# Altium project foxbms2-master.PrjPcb (part 7 of 8)

## Sheet interlock.SchDoc
size A3; DocumentNumber: 14; SheetNumber: 14; SheetTotal: 45; SheetDescription: Interlock Circuit
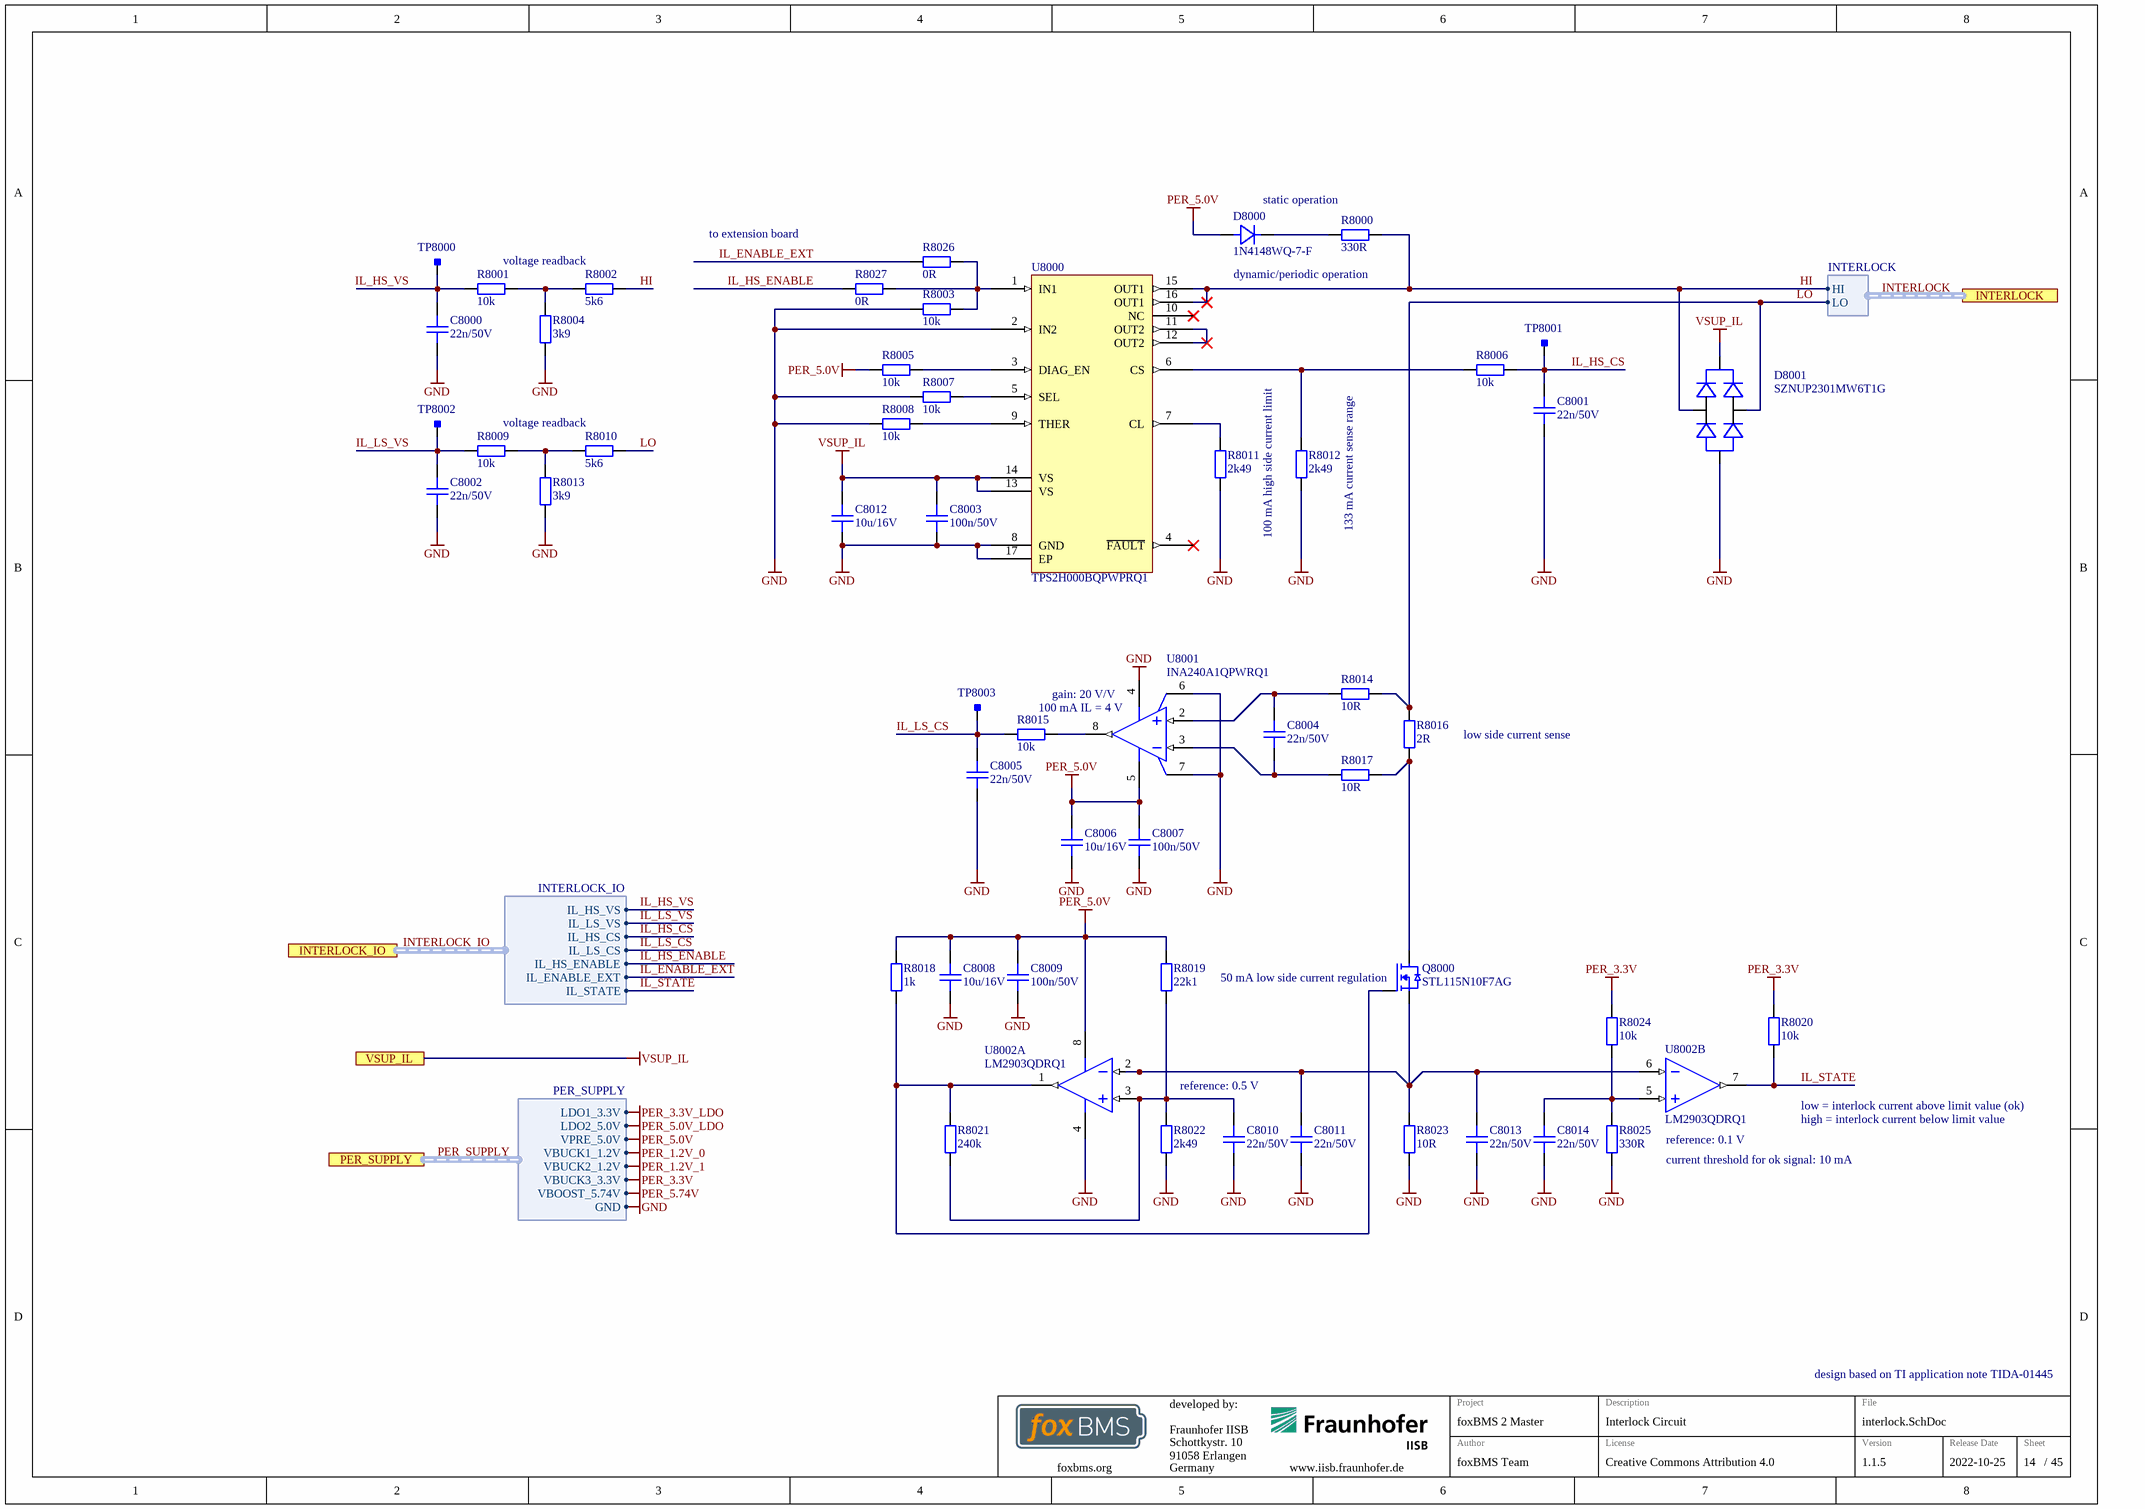
[diagram p43: interlock.SchDoc]

### Parts
C8000  22n/50V  [CAPC1005X06N]
C8001  22n/50V  [CAPC1005X06N]
C8002  22n/50V  [CAPC1005X06N]
C8003  100n/50V  [CAPC1005X06N]
C8004  22n/50V  [CAPC1005X06N]
C8005  22n/50V  [CAPC1005X06N]
C8006  10u/16V  [CAPC2012X14N]
C8007  100n/50V  [CAPC1005X06N]
C8008  10u/16V  [CAPC2012X14N]
C8009  100n/50V  [CAPC1005X06N]
C8010  22n/50V  [CAPC1005X06N]
C8011  22n/50V  [CAPC1005X06N]
C8012  10u/16V  [CAPC2012X14N]
C8013  22n/50V  [CAPC1005X06N]
C8014  22n/50V  [CAPC1005X06N]
D8000  1N4148WQ-7-F  [SOD-123_CASE-425-04-ISSUE-G]
D8001  SZNUP2301MW6T1G  [ONSEMI_SC-88_SOT-363]
Q8000  STL115N10F7AG  [ST_PowerFLAT_5x6_WF_type_C]
R8000  330R  [RESC1608X05N]
R8001  10k  [RESC1005X04N]
R8002  5k6  [RESC1005X04N]
R8003  10k  [RESC1005X04N]
R8004  3k9  [RESC1005X04N]
R8005  10k  [RESC1005X04N]
R8006  10k  [RESC1005X04N]
R8007  10k  [RESC1005X04N]
R8008  10k  [RESC1005X04N]
R8009  10k  [RESC1005X04N]
R8010  5k6  [RESC1005X04N]
R8011  2k49  [RESC1005X04N]
R8012  2k49  [RESC1005X04N]
R8013  3k9  [RESC1005X04N]
R8014  10R  [RESC1005X04N]
R8015  10k  [RESC1005X04N]
R8016  2R  [RESC2012X05N]
R8017  10R  [RESC1005X04N]
R8018  1k  [RESC1005X04N]
R8019  22k1  [RESC1005X04N]
R8020  10k  [RESC1005X04N]
R8021  240k  [RESC1005X04N]
R8022  2k49  [RESC1005X04N]
R8023  10R  [RESC2012X05N]
R8024  10k  [RESC1005X04N]
R8025  330R  [RESC1005X04N]
R8026  0R  [RESC1005X04N]
R8027  0R  [RESC1005X04N]
TP8000  Testpoint_Square  [Testpoint_S1]  (value not drawn)  (no BOM)
TP8001  Testpoint_Square  [Testpoint_S1]  (value not drawn)  (no BOM)
TP8002  Testpoint_Square  [Testpoint_S1]  (value not drawn)  (no BOM)
TP8003  Testpoint_Square  [Testpoint_S1]  (value not drawn)  (no BOM)
U8000  TPS2H000BQPWPRQ1  [TI_PWP0016J]
U8001  INA240A1QPWRQ1  [TI_PW0008A]
U8002  LM2903QDRQ1  [TI_D0008A]  (parts A,B of 2)

### Ports
INTERLOCK (harness INTERLOCK), INTERLOCK_IO (harness INTERLOCK_IO), PER_SUPPLY (harness PER_SUPPLY), VSUP_IL

### Harnesses
PER_SUPPLY: GND, VBOOST_5.74V, LDO1_3.3V, LDO2_5.0V, VPRE_5.0V, VBUCK1_1.2V, VBUCK2_1.2V, VBUCK3_3.3V
INTERLOCK: HI, LO
INTERLOCK_IO: IL_HS_CS, IL_LS_CS, IL_HS_VS, IL_LS_VS, IL_HS_ENABLE, IL_STATE, IL_ENABLE_EXT

### Nets
GND: C8000.1 C8001.1 C8002.1 C8003.1 C8005.1 C8006.1 C8007.1 C8008.1 C8009.1 C8010.1 C8011.2 C8012.1 C8013.2 C8014.1 D8001.1(Anode) R8003.2 R8004.1 R8007.2 R8008.2 R8011.2 R8012.2 R8013.1 R8022.1 R8023.2 R8025.1 U8000.2(IN2) U8000.8(GND) U8000.17(EP) U8001.4(-VS) U8001.6(REF2) U8001.7(REF1) U8002.4(GND) ; port PER_SUPPLY.GND
PER_3.3V: R8020.1 R8024.1 ; port PER_SUPPLY.VBUCK3_3.3V
PER_5.0V: C8006.2 C8007.2 C8008.2 C8009.2 D8000.2(A) R8005.2 R8018.2 R8019.1 U8001.5(+VS) U8002.8(VCC) ; port PER_SUPPLY.VPRE_5.0V
VSUP_IL: C8003.2 C8012.2 D8001.3(Cathode) U8000.13(VS) U8000.14(VS) ; port VSUP_IL  [project net VBB_12V]
HI: D8001.2(Common) R8000.1 R8002.2 U8000.15(OUT1) U8000.16(OUT1) ; port INTERLOCK.HI  [project net INTERLOCK.HI]
IL_ENABLE_EXT: R8026.1 ; port INTERLOCK_IO.IL_ENABLE_EXT  [project net EXT_CON.IL_ENABLE_EXT]
IL_HS_CS: C8001.2 R8006.1 TP8001.1 ; port INTERLOCK_IO.IL_HS_CS  [project net INTERLOCK_IO.IL_HS_CS]
IL_HS_ENABLE: R8027.1 ; port INTERLOCK_IO.IL_HS_ENABLE  [project net INTERLOCK_IO.IL_HS_ENABLE]
IL_HS_VS: C8000.2 R8001.1 TP8000.1 ; port INTERLOCK_IO.IL_HS_VS  [project net INTERLOCK_IO.IL_HS_VS]
IL_LS_CS: C8005.2 R8015.1 TP8003.1 ; port INTERLOCK_IO.IL_LS_CS  [project net INTERLOCK_IO.IL_LS_CS]
IL_LS_VS: C8002.2 R8009.1 TP8002.1 ; port INTERLOCK_IO.IL_LS_VS  [project net INTERLOCK_IO.IL_LS_VS]
IL_STATE: R8020.2 U8002.7(2OUT) ; port INTERLOCK_IO.IL_STATE  [project net EXT_CON.IL_STATE]
LO: D8001.5(Common) R8010.2 R8014.2 R8016.1 ; port INTERLOCK.LO  [project net INTERLOCK.LO]
NetC8004_1: C8004.1 R8017.1 U8001.3(-IN)
NetC8004_2: C8004.2 R8014.1 U8001.2(+IN)
NetC8010_2: C8010.2 R8019.2 R8021.1 R8022.2 U8002.3(1IN+)
NetC8011_1: C8011.1 C8013.1 Q8000.S R8023.1 U8002.2(1IN-) U8002.6(2IN-)
NetC8014_2: C8014.2 R8024.2 R8025.2 U8002.5(2IN+)
NetD8000_1: D8000.1(K) R8000.2
NetQ8000_D: Q8000.D R8016.2 R8017.2
NetQ8000_G: Q8000.G R8018.1 R8021.2 U8002.1(1OUT)
NetR8001_2: R8001.2 R8002.1 R8004.2
NetR8003_1: R8003.1 R8026.2 R8027.2 U8000.1(IN1)
NetR8005_1: R8005.1 U8000.3(DIAG_EN)
NetR8006_2: R8006.2 R8012.1 U8000.6(CS)
NetR8007_1: R8007.1 U8000.5(SEL)
NetR8008_1: R8008.1 U8000.9(THER)
NetR8009_2: R8009.2 R8010.1 R8013.2
NetR8011_1: R8011.1 U8000.7(CL)
NetR8015_2: R8015.2 U8001.8(VOUT)
NetU8000_11: U8000.11(OUT2) U8000.12(OUT2)

Not connected (* = marked no-connect by the designer): U8000 4(~{FAULT})* 10(NC)*

### Buses and harness runs
harness INTERLOCK = port INTERLOCK
harness INTERLOCK_IO = port INTERLOCK_IO
harness PER_SUPPLY = port PER_SUPPLY

### Notes on the sheet
- to extension board
- static operation
- voltage readback
- dynamic/periodic operation
- 100 mA high side current limit
- (near R8012) 133 mA current sense range
- (near U8001) 100 mA IL = 4 V
- (near U8001) gain: 20 V/V
- low side current sense
- (near Q8000) 50 mA low side current regulation
- reference: 0.5 V
- low = interlock current above limit value (ok)
- high = interlock current below limit value
- reference: 0.1 V
- current threshold for ok signal: 10 mA
- design based on TI application note TIDA-01445
- Fraunhofer IISB
- Schottkystr. 10
- developed by:
- 91058 Erlangen
- Germany
- Author
- Project
- License
- Description
- File
- Version
- Release Date
- Sheet
- foxbms.org <https://foxbms.org>
- www.iisb.fraunhofer.de <https://www.iisb.fraunhofer.de/>
- foxBMS Team
- /

### Library data of the parts
C8000-C8002 C8004 C8005 C8010 C8011 C8013 C8014 = gen_C_ceramic_22n_50V_X7R_0402: MLCC; Capacitance: 22n; Rated Voltage: 50V; Dielectric: X7R; Case EIA: 0402; Case Metric: 1005; Automotive Qualified: True; AEC-Q Norm: AEC-Q200; AEC-Q Grade: Grade 1; PnP Package: 0402C; Part Number: gen_C_ceramic_22n_50V_X7R_0402; Supplier 1: Digikey; Supplier Part Number 1: 490-4763-1-ND; ECCN: EAR99
C8003 C8007 C8009 = gen_C_ceramic_100n_50V_X7R_0402: MLCC; Capacitance: 100n; Rated Voltage: 50V; Dielectric: X7R; Case EIA: 0402; Case Metric: 1005; PnP Package: 0402C; PnP Value: 100nF/50V/X7R; PnP equipped: x; Automotive Qualified: True; AEC-Q Norm: AEC-Q200; Part Number: gen_C_ceramic_100n_50V_X7R_0402; Supplier 1: Farnell; Supplier Part Number 1: 2210822; ECCN: EAR99
C8006 C8008 C8012 = gen_C_ceramic_10u_16V_X7R_0805: MLCC; Capacitance: 10u; Rated Voltage: 16V; Dielectric: X7S; Case EIA: 0805; Case Metric: 2012; Automotive Qualified: True; AEC-Q Grade: Grade 1; AEC-Q Norm: AEC-Q200; Part Number: gen_C_ceramic_10u_16V_X7R_0805; ECCN: EAR99; Supplier 1: Digikey; Supplier Part Number 1: 445-16110-1-ND
D8000 = 1N4148WQ-7-F: Diode; Manufacturer: Diodes Inc.; Breakdown Voltage: 100V; Continuous Forward Current: 300mA; PnP Package: SOD123; Automotive Qualified: True; Part Number: 1N4148WQ-7-F; Part Name: 1N4148WQ-7-F; Operating Temperature: -65°C - +150°C; ComponentLink1Description: Datasheet; ComponentLink1URL: https://www.diodes.com/assets/Datasheets/ds30086.pdf; Supplier 1: Digikey; Supplier Part Number 1: 1N4148WQ-7-FDICT-ND
D8001 = SZNUP2301MW6T1G: TVS diode array; Manufacturer: ON Semiconductor; Breakdown Voltage: 70V; Automotive Qualified: True; AEC-Q Norm: AEC-Q101; AEC-Q Grade: Grade 0; Part Number: SZNUP2301MW6T1G; Part Name: SZNUP2301MW6T1G; Operating Temperature: -55°C - +150°C; ComponentLink1Description: Datasheet; ComponentLink1URL: https://www.mouser.de/datasheet/2/308/1/NUP2301MW6T1_D-2319422.pdf; Supplier 1: Mouser; Supplier Part Number 1: 863-SZNUP2301MW6T1G; ECCN: EAR99
Q8000 = STL115N10F7AG: N-Channel MOSFET, 100 V, 107 A, 5 mOhm; Manufacturer: STMicroelectronics; Maximum Drain-Source Voltage: 100V; Maximum Continous Drain Current (25°C): 107A; R_DS(on): 5m; Total Gate Charge: 72.5nC; Automotive Qualified: True; AEC-Q Norm: AEC-Q101; AEC-Q Grade: Grade 0; Part Number: STL115N10F7AG; Part Name: NMOS; Operating Temperature: -55°C - +175°C; ComponentLink1Description: Datasheet; ComponentLink1URL: https://www.mouser.de/datasheet/2/389/dm00333356-1798814.pdf; Supplier 1: Mouser; Supplier Part Number 1: 511-STL115N10F7AG; Supplier 2: Digikey; Supplier Part Number 2: 497-17622-1-ND; ECCN: EAR99
R8000 = gen_R_330R_0603: SMD Resistor 330R 0603; Power: 0.1W; Case EIA: 0603; Case Metric: 1608; Maximum Working Voltage: 75V; PnP Package: 0603R; Automotive Qualified: True; Tolerance: 1%; Part Number: gen_R_330R_0603; Operating Temperature: -55°C - +155°C; Resistance: 330R; Series: E24; PnP Value: 330R; Supplier 1: Farnell; Supplier Part Number 1: 2692155
R8001 R8003 R8005-R8009 R8015 R8020 R8024 = gen_R_10k_0402: SMD Resistor 10k 0402; Power: 0.063W; Case EIA: 0402; Case Metric: 1005; Maximum Working Voltage: 50V; PnP Package: 0402R; Automotive Qualified: True; Tolerance: 1%; PnP equipped: x; AEC-Q Norm: AEC-Q200; Part Number: gen_R_10k_0402; Operating Temperature: -55°C - +155°C; Resistance: 10k; Series: E24, E96; PnP Value: 10k; Supplier 1: Farnell; Supplier Part Number 1: 2059239; ECCN: EAR99
R8002 R8010 = gen_R_5k6_0402: SMD Resistor 5k6 0402; Power: 0.063W; Case EIA: 0402; Case Metric: 1005; Maximum Working Voltage: 50V; PnP Package: 0402R; Automotive Qualified: True; Tolerance: 1%; AEC-Q Norm: AEC-Q200; AEC-Q Grade: Grade 0; Part Number: gen_R_5k6_0402; Operating Temperature: -55°C - +155°C; Resistance: 5k6; Series: E24; PnP Value: 5k6; Supplier 1: Digikey; Supplier Part Number 1: A129636CT-ND; ECCN: EAR99
R8004 R8013 = gen_R_3k9_0402: SMD Resistor 3k9 0402; Power: 0.063W; Case EIA: 0402; Case Metric: 1005; Maximum Working Voltage: 50V; PnP Package: 0402R; Automotive Qualified: True; Tolerance: 1%; AEC-Q Grade: Grade 0; AEC-Q Norm: AEC-Q200; Part Number: gen_R_3k9_0402; Operating Temperature: -55°C - +155°C; Resistance: 3k9; Series: E24; PnP Value: 3k9; ECCN: EAR99; Supplier 1: Farnell; Supplier Part Number 1: 2302698
R8011 R8012 R8022 = gen_R_2k49_0402: SMD Resistor 2k49 0402; Power: 0.063W; Case EIA: 0402; Case Metric: 1005; Maximum Working Voltage: 50V; PnP Package: 0402R; Automotive Qualified: True; Tolerance: 1%; Part Number: gen_R_2k49_0402; Operating Temperature: -55°C - +155°C; Resistance: 2k49; Series: E96; PnP Value: 2k49; Supplier 1: Farnell; Supplier Part Number 1: 2059135
R8014 R8017 = gen_R_10R_0402: SMD Resistor 10R 0402; Power: 0.063W; Case EIA: 0402; Case Metric: 1005; Maximum Working Voltage: 50V; PnP Package: 0402R; Automotive Qualified: True; Tolerance: 1%; Part Number: gen_R_10R_0402; Operating Temperature: -55°C - +155°C; Resistance: 10R; Series: E24, E96; PnP Value: 10R; Supplier 1: Farnell; Supplier Part Number 1: 2302417
R8016 = gen_R_2R_0805: SMD Resistor 2R 0805; Power: 0.125W; Case EIA: 0805; Case Metric: 2012; Maximum Working Voltage: 150V; PnP Package: 0805R; Automotive Qualified: True; Tolerance: 1%; AEC-Q Grade: Grade 0; AEC-Q Norm: AEC-Q200; Part Number: gen_R_2R_0805; Operating Temperature: -55°C - +155°C; Resistance: 2R; Series: E24, E96; PnP Value: 2R; ECCN: EAR99; Supplier 1: Digikey; Supplier Part Number 1: P19275CT-ND
R8018 = gen_R_1k_0402: SMD Resistor 1k 0402; Power: 0.063W; Case EIA: 0402; Case Metric: 1005; Maximum Working Voltage: 50V; PnP Package: 0402R; Automotive Qualified: True; Tolerance: 1%; PnP equipped: x; AEC-Q Norm: AEC-Q200; Part Number: gen_R_1k_0402; Operating Temperature: -55°C - +155°C; Resistance: 1k; Series: E24, E96; PnP Value: 1k; Supplier 1: Farnell; Supplier Part Number 1: 2302638; ECCN: EAR99
R8019 = gen_R_22k1_0402: SMD Resistor 22k1 0402; Power: 0.063W; Case EIA: 0402; Case Metric: 1005; Maximum Working Voltage: 50V; PnP Package: 0402R; Automotive Qualified: True; Tolerance: 1%; AEC-Q Norm: AEC-Q200; AEC-Q Grade: Grade 0; Part Number: gen_R_22k1_0402; Operating Temperature: -55°C - +155°C; Resistance: 22k1; Series: E96; PnP Value: 22k1; ECCN: EAR99; Supplier 1: Farnell; Supplier Part Number 1: 2563485
R8021 = gen_R_240k_0402: SMD Resistor 240k 0402; Power: 0.063W; Case EIA: 0402; Case Metric: 1005; Maximum Working Voltage: 50V; PnP Package: 0402R; Automotive Qualified: True; Tolerance: 1%; AEC-Q Norm: AEC-Q200; AEC-Q Grade: Grade 0; Part Number: gen_R_240k_0402; Operating Temperature: -55°C - +155°C; Resistance: 240k; Series: E24; PnP Value: 240k; Supplier 1: Digikey; Supplier Part Number 1: P240KLCT-ND; ECCN: EAR99
R8023 = gen_R_10R_0805: SMD Resistor 10R 0805; Power: 0.125W; Case EIA: 0805; Case Metric: 2012; Maximum Working Voltage: 150V; PnP Package: 0805R; Automotive Qualified: True; Tolerance: 1%; AEC-Q Grade: Grade 0; AEC-Q Norm: AEC-Q200; Part Number: gen_R_10R_0805; Operating Temperature: -55°C - +155°C; Resistance: 10R; Series: E24, E96; PnP Value: 10R; ECCN: EAR99; Supplier 1: Farnell; Supplier Part Number 1: 1750728
R8025 = gen_R_330R_0402: SMD Resistor 330R 0402; Power: 0.063W; Case EIA: 0402; Case Metric: 1005; Maximum Working Voltage: 50V; PnP Package: 0402R; Automotive Qualified: True; Tolerance: 1%; AEC-Q Grade: Grade 0; AEC-Q Norm: AEC-Q200; Part Number: gen_R_330R_0402; Operating Temperature: -55°C - +155°C; Resistance: 330R; Series: E24; PnP Value: 330R; ECCN: EAR99; Supplier 1: Farnell; Supplier Part Number 1: 2302581
R8026 R8027 = gen_R_0R_0402: SMD Resistor 0R 0402; Power: 0.063W; Case EIA: 0402; Case Metric: 1005; Maximum Working Voltage: 50V; PnP Package: 0402R; Automotive Qualified: True; AEC-Q Norm: AEC-Q200; PnP equipped: x; Part Number: gen_R_0R_0402; Operating Temperature: -55°C - +155°C; Resistance: 0R; Series: Jumper; PnP Value: 0R; Supplier 1: Farnell; Supplier Part Number 1: 1469661; Supplier 2: Farnell; Supplier Part Number 2: 2059190; ECCN: EAR99
TP8000-TP8003 = Testpoint_Square: Testpoint, square; Automotive Qualified: False; Part Number: Testpoint_Square
U8000 = TPS2H000BQPWPRQ1: 1000-mΩ Dual-Channel SmartHigh-Side Power Switch; Manufacturer: Texas Instruments; Automotive Qualified: True; AEC-Q Norm: AEC-Q100; AEC-Q Grade: Grade 1; Part Number: TPS2H000BQPWPRQ1; Part Name: TPS2H000BQPWPRQ1; Operating Temperature: −40°C - +125°C; ComponentLink1Description: Datasheet; ComponentLink1URL: http://www.ti.com/lit/ds/symlink/tps2h000-q1.pdf; Supplier 1: Mouser; Supplier Part Number 1: 595-TPS2H000BQPWPRQ1; Supplier 2: Digikey; Supplier Part Number 2: 296-45179-1-ND; Supplier 3: Farnell; Supplier Part Number 3: 3124090; ECCN: EAR99
U8001 = INA240A1QPWRQ1: Automotive, Wide Common-Mode Range, High- and Low-Side, Bidirectional, Zero-Drift, Current-Sense Amplifier With Enhanced PWM Rejection; Manufacturer: Texas Instruments; Amplifier Type: Instrumentation; Number of Circuits: 1; Slew Rate: 35V/µs; Mfg Application Notes: WaterAnalysisSolutionforpH&ConductivityMeters; Current - Supply: 2mA; Voltage - Supply, Single/Dual (±): 5V~36V,±2.5V~18V; Current - Input Bias: 1nA; Product Training Modules: CommonPhotodiodeOp-AmpCircuitProblemsandSolutionsIndirectCurrentFeedbackInstrumentationAmplifierApplicationsGuide; Voltage - Input Offset: 60µV; Featured Product: AD8421InstrumentationAmplifier; EDA / CAD Models: DownloadfromAcceleratedDesigns; -3db Bandwidth: 10MHz; Package Version: 10/2009; Current - Output / Channel: 65mA; Automotive Qualified: True; AEC-Q Norm: AEC-Q100; AEC-Q Grade: Grade 1; Series: -; Category: IntegratedCircuits(ICs); Output Type: -; Package Reference: RM-8; Datasheet Version: Rev. 0, 05/2012; Family: Linear-Amplifiers-Instrumentation,OPAmps,BufferAmps; Packaging: Tube; Standard Package: 50; Online Catalog: Instrumentation; Operating Temperature: −40°C - +125°C; Package Description: 8-Pin Mini Small Outline Package, Body 3 x 3 mm, Pitch 0.65 mm; Package / Case: 8-TSSOP,8-MSOP(0.118",3.00mmWidth); Mounting Technology: SurfaceMount; Manufacturer URL: http://www.analog.com/; Mounting Type: SurfaceMount; Datasheet URL: http://www.analog.com/media/en/technical-documentation/data-sheets/AD8421.pdf; Gain Bandwidth Product: -; Supplier Device Package: 8-MSOP; Package URL: http://www.analog.com/static/imported-files/packages/PKG_PDF/MSOP%28RM%29/RM_8.pdf; Part Number: INA240A1QPWRQ1; Part Name: INA240A1QPWRQ1; ComponentLink1Description: Datasheet; ComponentLink1URL: http://www.ti.com/lit/ds/symlink/ina240-q1.pdf; Supplier 1: Mouser; Supplier Part Number 1: 595-INA240A1QPWRQ1; Supplier 2: Digikey; Supplier Part Number 2: 296-50472-1-ND; ECCN: EAR99
U8002 = LM2903QDRQ1: Automotive Dual Comparators; Manufacturer: Texas Instruments; Automotive Qualified: True; AEC-Q Norm: AEC-Q100; AEC-Q Grade: Grade 1; Part Number: LM2903QDRQ1; Part Name: LM2903QDRQ1; Operating Temperature: −40°C - +125°C; ComponentLink1Description: Datasheet; ComponentLink1URL: http://www.ti.com/lit/ds/symlink/lm2903-q1.pdf; Supplier 1: Mouser; Supplier Part Number 1: 595-LM2903QDRQ1; Supplier 2: Digikey; Supplier Part Number 2: 296-15183-1-ND; ECCN: EAR99

## Sheet connectors-interface.SchDoc
size A3; DocumentNumber: 12; SheetNumber: 12; SheetTotal: 45; SheetDescription: Connector to Interface Board
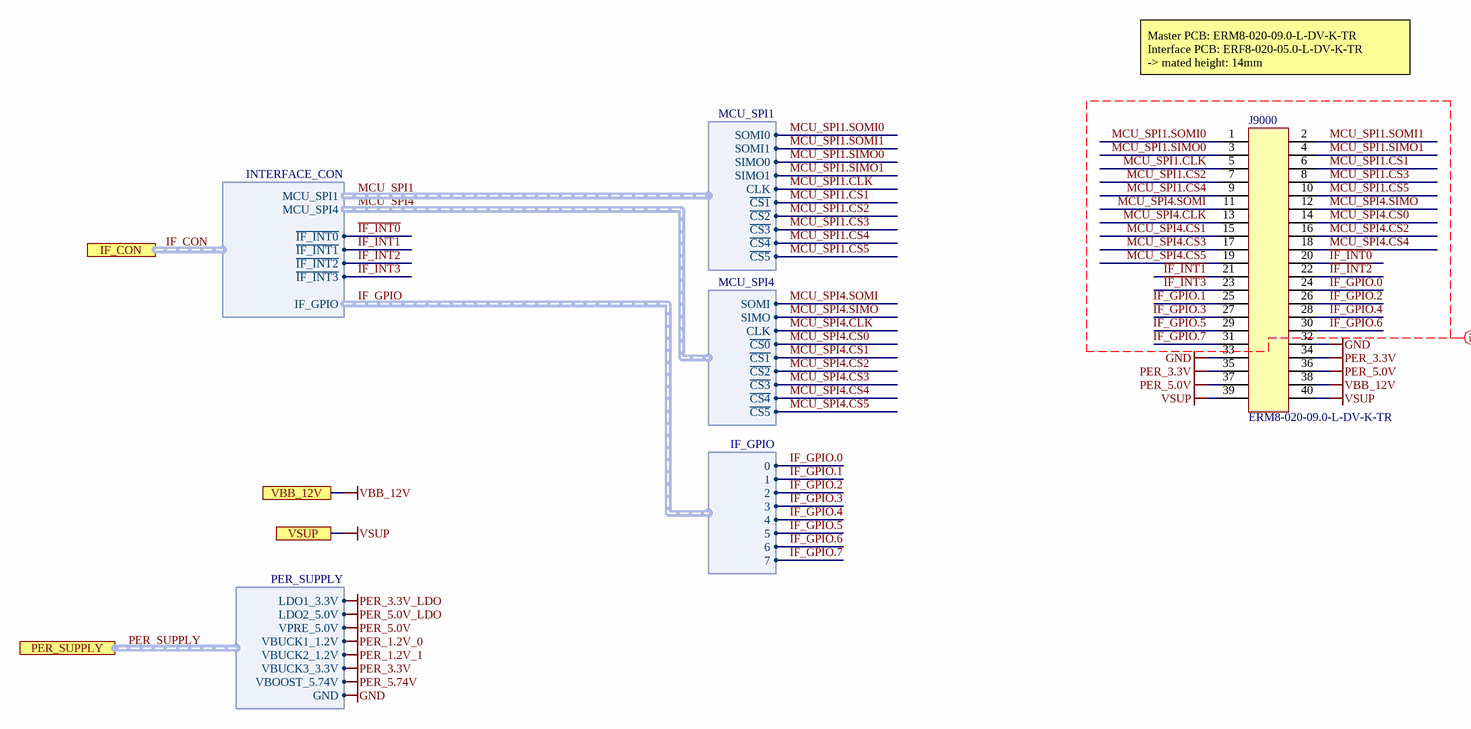
[diagram p44: connectors-interface.SchDoc]

### Parts
J9000  ERM8-020-09.0-L-DV-K-TR  [SAMTEC_ERM8-020-09.0-L-DV-K]

### Ports
IF_CON (harness INTERFACE_CON), PER_SUPPLY (harness PER_SUPPLY), VBB_12V, VSUP

### Harnesses
MCU_SPI1: CLK, SIMO0, SOMI0, SOMI1, ~{CS1}, ~{CS2}, ~{CS3}, ~{CS4}, ~{CS5}, SIMO1
MCU_SPI4: CLK, SIMO, SOMI, ~{CS1}, ~{CS2}, ~{CS3}, ~{CS0}, ~{CS4}, ~{CS5}
IF_GPIO: 0, 1, 2, 3, 4, 5, 6, 7
PER_SUPPLY: GND, VBOOST_5.74V, LDO1_3.3V, LDO2_5.0V, VPRE_5.0V, VBUCK1_1.2V, VBUCK2_1.2V, VBUCK3_3.3V
INTERFACE_CON: MCU_SPI1, MCU_SPI4, ~{IF_INT0}, ~{IF_INT1}, ~{IF_INT2}, ~{IF_INT3}, IF_GPIO

### Nets
GND: J9000.32 J9000.33 ; port PER_SUPPLY.GND
PER_3.3V: J9000.34 J9000.35 ; port PER_SUPPLY.VBUCK3_3.3V
PER_5.0V: J9000.36 J9000.37 ; port PER_SUPPLY.VPRE_5.0V
VBB_12V: J9000.38 ; port VBB_12V
VSUP: J9000.39 J9000.40 ; port VSUP  [project net VSUP_30]
~{IF_INT0}: J9000.20 ; port IF_CON.~{IF_INT0}  [project net IF_CON~{.}IF_INT0]
~{IF_INT1}: J9000.21 ; port IF_CON.~{IF_INT1}  [project net IF_CON~{.}IF_INT1]
~{IF_INT2}: J9000.22 ; port IF_CON.~{IF_INT2}  [project net IF_CON~{.}IF_INT2]
~{IF_INT3}: J9000.23 ; port IF_CON.~{IF_INT3}  [project net IF_CON~{.}IF_INT3]
~{MCU_SPI1.CS1}: J9000.6 ; harness MCU_SPI1.~{CS1}  [project net MCU_SPI1~{.}CS1]
~{MCU_SPI1.CS2}: J9000.7 ; harness MCU_SPI1.~{CS2}  [project net MCU_SPI1~{.}CS2]
~{MCU_SPI1.CS3}: J9000.8 ; harness MCU_SPI1.~{CS3}  [project net MCU_SPI1~{.}CS3]
~{MCU_SPI1.CS4}: J9000.9 ; harness MCU_SPI1.~{CS4}  [project net MCU_SPI1~{.}CS4]
~{MCU_SPI1.CS5}: J9000.10 ; harness MCU_SPI1.~{CS5}  [project net MCU_SPI1~{.}CS5]
~{MCU_SPI4.CS0}: J9000.14 ; harness MCU_SPI4.~{CS0}  [project net MCU_SPI4~{.}CS0]
~{MCU_SPI4.CS1}: J9000.15 ; harness MCU_SPI4.~{CS1}  [project net MCU_SPI4~{.}CS1]
~{MCU_SPI4.CS2}: J9000.16 ; harness MCU_SPI4.~{CS2}  [project net MCU_SPI4~{.}CS2]
~{MCU_SPI4.CS3}: J9000.17 ; harness MCU_SPI4.~{CS3}  [project net MCU_SPI4~{.}CS3]
~{MCU_SPI4.CS4}: J9000.18 ; harness MCU_SPI4.~{CS4}  [project net MCU_SPI4~{.}CS4]
~{MCU_SPI4.CS5}: J9000.19 ; harness MCU_SPI4.~{CS5}  [project net MCU_SPI4~{.}CS5]
IF_GPIO.0: J9000.24 ; harness IF_GPIO.0
IF_GPIO.1: J9000.25 ; harness IF_GPIO.1
IF_GPIO.2: J9000.26 ; harness IF_GPIO.2
IF_GPIO.3: J9000.27 ; harness IF_GPIO.3
IF_GPIO.4: J9000.28 ; harness IF_GPIO.4
IF_GPIO.5: J9000.29 ; harness IF_GPIO.5
IF_GPIO.6: J9000.30 ; harness IF_GPIO.6
IF_GPIO.7: J9000.31 ; harness IF_GPIO.7
MCU_SPI1.CLK: J9000.5 ; harness MCU_SPI1.CLK
MCU_SPI1.SIMO0: J9000.3 ; harness MCU_SPI1.SIMO0
MCU_SPI1.SIMO1: J9000.4 ; harness MCU_SPI1.SIMO1
MCU_SPI1.SOMI0: J9000.1 ; harness MCU_SPI1.SOMI0
MCU_SPI1.SOMI1: J9000.2 ; harness MCU_SPI1.SOMI1
MCU_SPI4.CLK: J9000.13 ; harness MCU_SPI4.CLK
MCU_SPI4.SIMO: J9000.12 ; harness MCU_SPI4.SIMO
MCU_SPI4.SOMI: J9000.11 ; harness MCU_SPI4.SOMI

### Buses and harness runs
harness IF_CON = port IF_CON
harness PER_SUPPLY = port PER_SUPPLY

### Layout directives
net class CON_IF: IF_GPIO.0, IF_GPIO.1, IF_GPIO.2, IF_GPIO.3, IF_GPIO.4, IF_GPIO.5, IF_GPIO.6, IF_GPIO.7, MCU_SPI1.CLK, MCU_SPI1.SIMO0, MCU_SPI1.SIMO1, MCU_SPI1.SOMI0, MCU_SPI1.SOMI1, MCU_SPI4.CLK, MCU_SPI4.SIMO, MCU_SPI4.SOMI, ~{IF_INT0}, ~{IF_INT1}, ~{IF_INT2}, ~{IF_INT3}, ~{MCU_SPI1.CS1}, ~{MCU_SPI1.CS2}, ~{MCU_SPI1.CS3}, ~{MCU_SPI1.CS4}, ~{MCU_SPI1.CS5}, ~{MCU_SPI4.CS0}, ~{MCU_SPI4.CS1}, ~{MCU_SPI4.CS2}, ~{MCU_SPI4.CS3}, ~{MCU_SPI4.CS4}, ~{MCU_SPI4.CS5}

### Notes on the sheet
- Master PCB: ERM8-020-09.0-L-DV-K-TR
  Interface PCB: ERF8-020-05.0-L-DV-K-TR
  -> mated height: 14mm
- Fraunhofer IISB
- Schottkystr. 10
- developed by:
- 91058 Erlangen
- Germany
- Author
- Project
- License
- Description
- File
- Version
- Release Date
- Sheet
- foxbms.org <https://foxbms.org>
- www.iisb.fraunhofer.de <https://www.iisb.fraunhofer.de/>
- foxBMS Team
- /

### Library data of the parts
J9000 = SAMTEC_ERM8-020-09.0-L-DV-K-TR: Edge Rate rugged high-speed connector strips; Manufacturer: Samtec; Circuits: 40; Automotive Qualified: False; Part Number: SAMTEC_ERM8-020-09.0-L-DV-K-TR; Part Name: ERM8-020-09.0-L-DV-K-TR; Operating Temperature: -55°C - +125°C; ComponentLink1Description: Datasheet; ComponentLink1URL: https://suddendocs.samtec.com/catalog_english/erm8.pdf; Supplier 1: Farnell; Supplier Part Number 1: 3551150; Supplier 2: Samtec; Supplier Part Number 2: ERM8-020-09.0-L-DV-K-TR; Supplier 3: RS Components; Supplier Part Number 3: 1798876; ECCN: EAR99; System: Connector

## Sheet connectors-extension.SchDoc
size A3; DocumentNumber: 10; SheetNumber: 10; SheetTotal: 45; SheetDescription: Connector to Extension Board
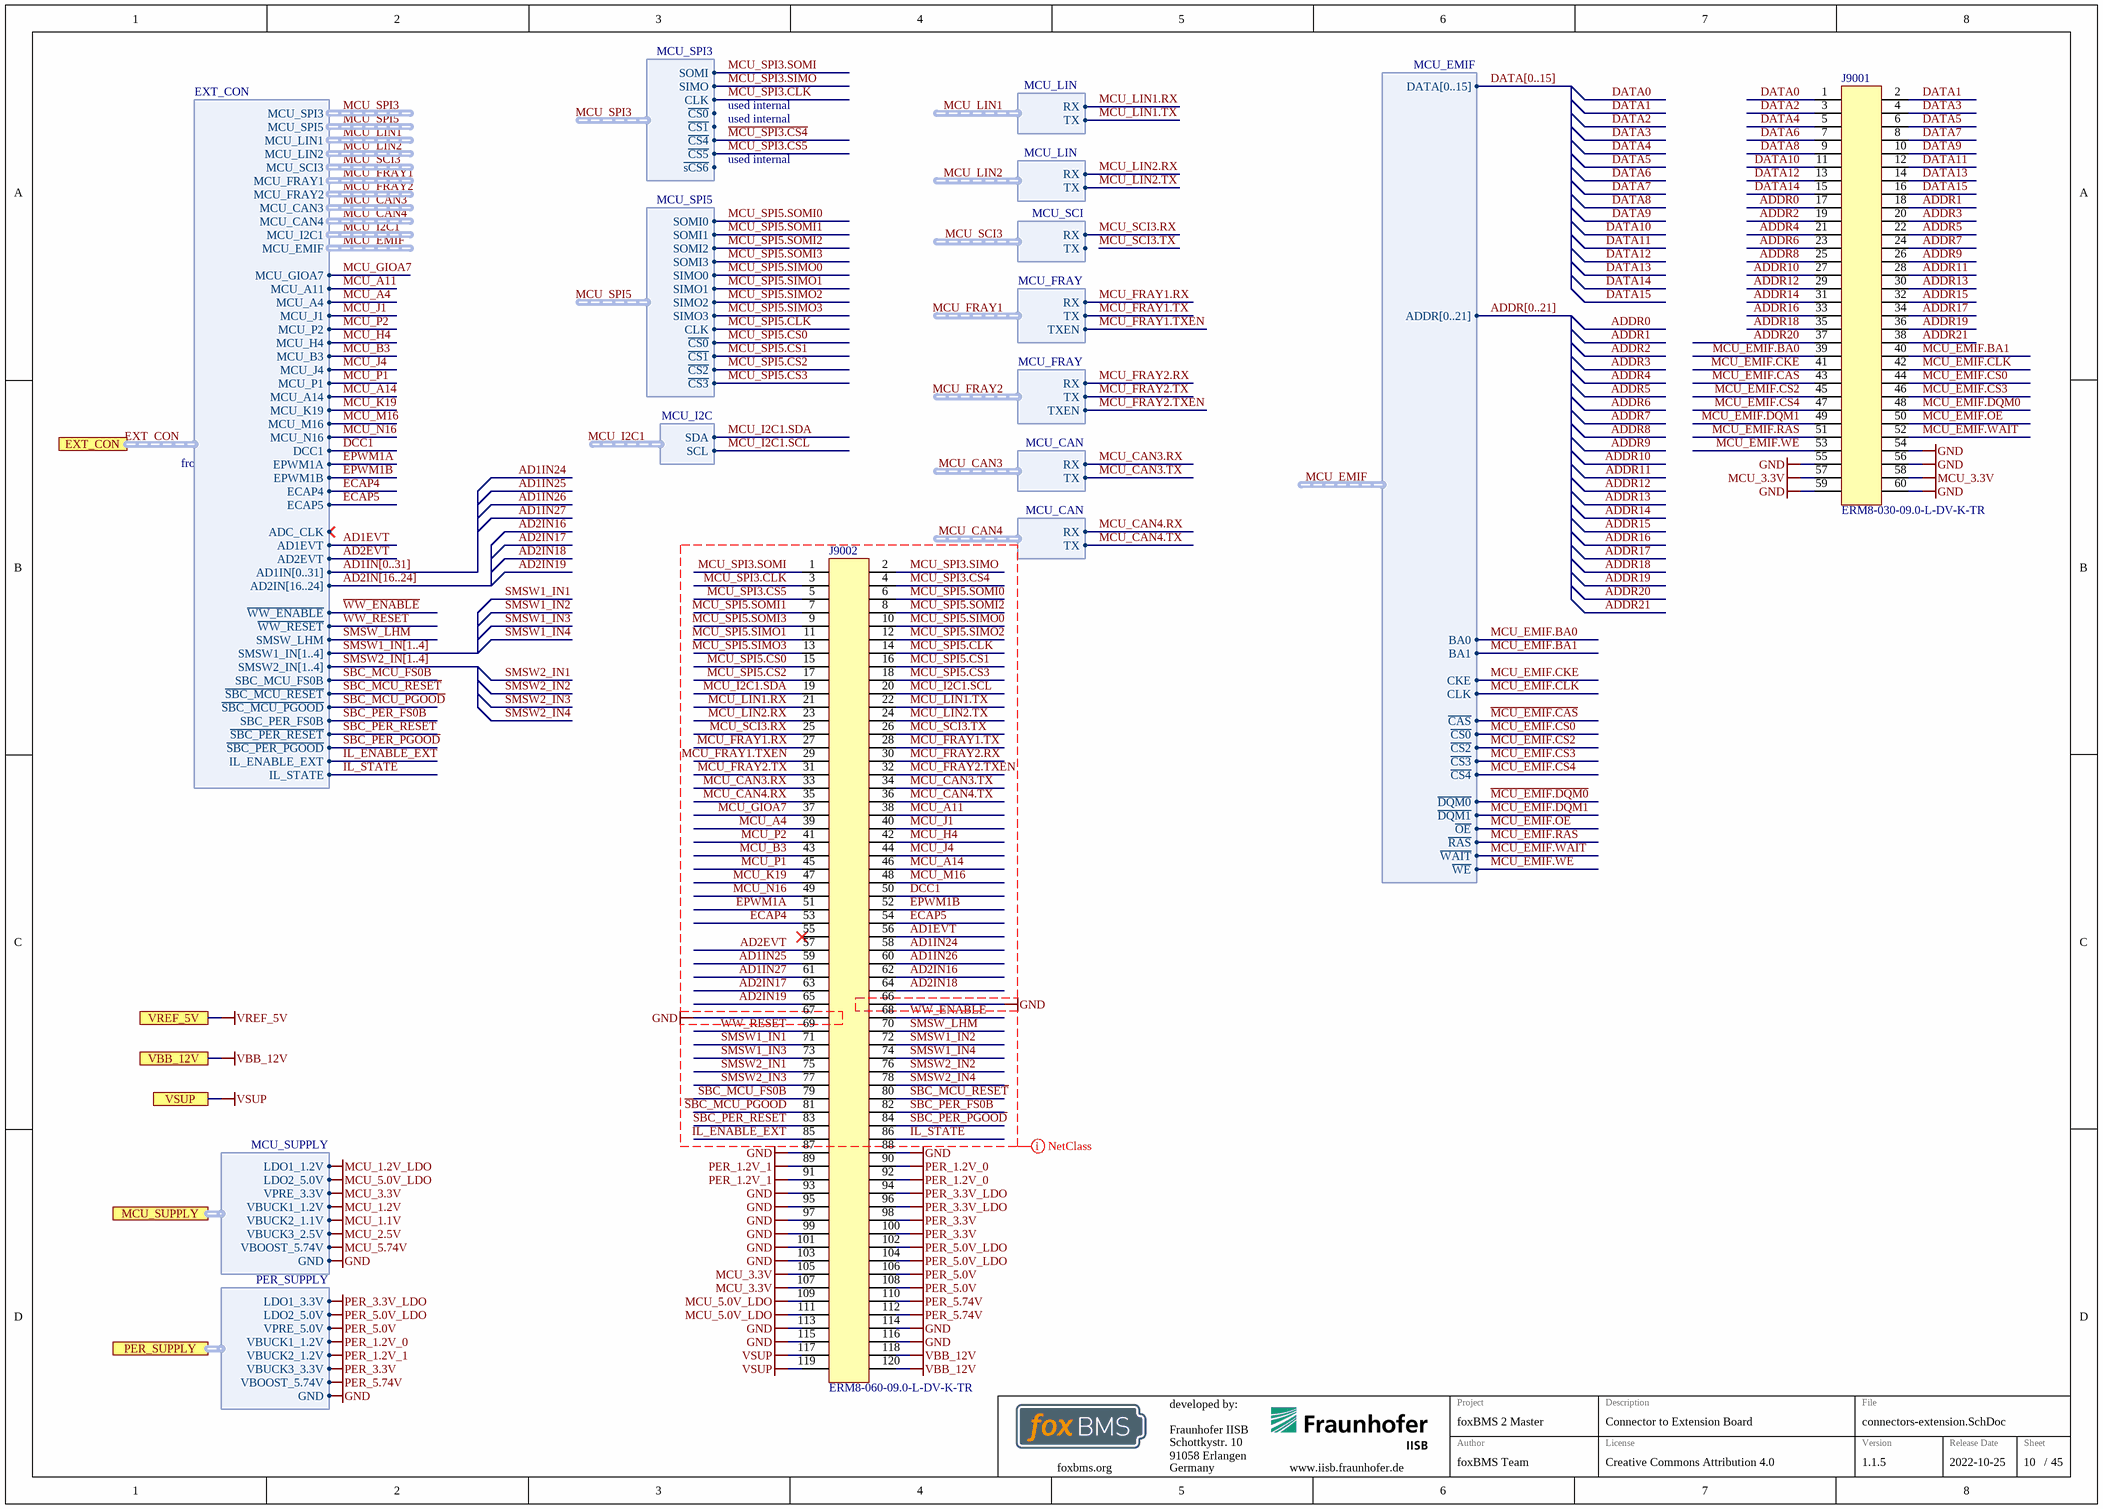
[diagram p45: connectors-extension.SchDoc]

### Parts
J9001  ERM8-030-09.0-L-DV-K-TR  [SAMTEC_ERM8-030-09.0-L-DV-K]
J9002  ERM8-060-09.0-L-DV-K-TR  [SAMTEC_ERM8-060-09.0-L-DV-K]

### Ports
EXT_CON (harness EXT_CON), MCU_SUPPLY (harness MCU_SUPPLY), PER_SUPPLY (harness PER_SUPPLY), VBB_12V, VREF_5V, VSUP

### Harnesses
MCU_SPI5: CLK, SIMO0, SOMI0, SOMI1, ~{CS1}, ~{CS2}, ~{CS3}, ~{CS0}, SIMO1, SIMO2, SIMO3, SOMI2, SOMI3
MCU_SPI3: CLK, SIMO, SOMI, ~{CS1}, ~{CS4}, ~{CS5}, ~{CS0}, ~{sCS6}
MCU_I2C: SDA, SCL
MCU_SUPPLY: VBUCK1_1.2V, VBUCK2_1.1V, VBUCK3_2.5V, LDO1_1.2V, LDO2_5.0V, GND, VPRE_3.3V, VBOOST_5.74V
PER_SUPPLY: GND, VBOOST_5.74V, LDO1_3.3V, LDO2_5.0V, VPRE_5.0V, VBUCK1_1.2V, VBUCK2_1.2V, VBUCK3_3.3V
MCU_EMIF: DATA[0..15], ADDR[0..21], BA0, BA1, CKE, CLK, ~{CAS}, ~{CS0}, ~{CS2}, ~{CS3}, ~{CS4}, ~{DQM1}, ~{DQM0}, ~{OE}, ~{RAS}, ~{WAIT}, ~{WE}
MCU_CAN: RX, TX
MCU_FRAY: RX, TX, TXEN
MCU_LIN: RX, TX
EXT_CON: MCU_SPI3, MCU_SPI5, MCU_LIN1, MCU_LIN2, MCU_FRAY1, MCU_FRAY2, MCU_CAN3, MCU_CAN4, MCU_I2C1, MCU_EMIF, DCC1, EPWM1A, EPWM1B, ECAP4, ECAP5, ADC_CLK, AD1EVT, AD2EVT, AD1IN[0..31], AD2IN[16..24], ~{WW_ENABLE}, ~{WW_RESET}, SMSW_LHM, SMSW1_IN[1..4], SMSW2_IN[1..4], SBC_MCU_FS0B, ~{SBC_MCU_RESET}, ~{SBC_MCU_PGOOD}, SBC_PER_FS0B, ~{SBC_PER_RESET}, ~{SBC_PER_PGOOD}, IL_ENABLE_EXT, IL_STATE, MCU_GIOA7, MCU_A11, MCU_A4, MCU_J1, MCU_P2, MCU_H4, MCU_B3, MCU_J4, MCU_P1, MCU_A14, MCU_K19, MCU_M16, MCU_N16, MCU_SCI3
MCU_SCI: RX, TX

### Nets
GND: J9001.54 J9001.55 J9001.56 J9001.59 J9001.60 J9002.66 J9002.67 J9002.87 J9002.88 J9002.93 J9002.95 J9002.97 J9002.99 J9002.101 J9002.103 J9002.113 J9002.114 J9002.115 J9002.116 ; port MCU_SUPPLY.GND, port PER_SUPPLY.GND
MCU_3.3V: J9001.57 J9001.58 J9002.105 J9002.107 ; port MCU_SUPPLY.VPRE_3.3V
MCU_5.0V_LDO: J9002.109 J9002.111 ; port MCU_SUPPLY.LDO2_5.0V
PER_1.2V_0: J9002.90 J9002.92 ; port PER_SUPPLY.VBUCK1_1.2V
PER_1.2V_1: J9002.89 J9002.91 ; port PER_SUPPLY.VBUCK2_1.2V
PER_3.3V: J9002.98 J9002.100 ; port PER_SUPPLY.VBUCK3_3.3V
PER_3.3V_LDO: J9002.94 J9002.96 ; port PER_SUPPLY.LDO1_3.3V
PER_5.0V: J9002.106 J9002.108 ; port PER_SUPPLY.VPRE_5.0V
PER_5.0V_LDO: J9002.102 J9002.104 ; port PER_SUPPLY.LDO2_5.0V
PER_5.74V: J9002.110 J9002.112 ; port PER_SUPPLY.VBOOST_5.74V
VBB_12V: J9002.118 J9002.120 ; port VBB_12V
VSUP: J9002.117 J9002.119 ; port VSUP  [project net VSUP_30]
~{MCU_EMIF.CAS}: J9001.43 ; harness MCU_EMIF.~{CAS}  [project net MCU_EMIF~{.}CAS]
~{MCU_EMIF.CS0}: J9001.44 ; harness MCU_EMIF.~{CS0}  [project net MCU_EMIF~{.}CS0]
~{MCU_EMIF.CS2}: J9001.45 ; harness MCU_EMIF.~{CS2}  [project net MCU_EMIF~{.}CS2]
~{MCU_EMIF.CS3}: J9001.46 ; harness MCU_EMIF.~{CS3}  [project net MCU_EMIF~{.}CS3]
~{MCU_EMIF.CS4}: J9001.47 ; harness MCU_EMIF.~{CS4}  [project net MCU_EMIF~{.}CS4]
~{MCU_EMIF.DQM0}: J9001.48 ; harness MCU_EMIF.~{DQM0}  [project net MCU_EMIF~{.}DQM0]
~{MCU_EMIF.DQM1}: J9001.49 ; harness MCU_EMIF.~{DQM1}  [project net MCU_EMIF~{.}DQM1]
~{MCU_EMIF.OE}: J9001.50 ; harness MCU_EMIF.~{OE}  [project net MCU_EMIF~{.}OE]
~{MCU_EMIF.RAS}: J9001.51 ; harness MCU_EMIF.~{RAS}  [project net MCU_EMIF~{.}RAS]
~{MCU_EMIF.WAIT}: J9001.52 ; harness MCU_EMIF.~{WAIT}  [project net MCU_EMIF~{.}WAIT]
~{MCU_EMIF.WE}: J9001.53 ; harness MCU_EMIF.~{WE}  [project net MCU_EMIF~{.}WE]
~{MCU_SPI3.CS4}: J9002.4 ; harness MCU_SPI3.~{CS4}  [project net MCU_SPI3~{.}CS4]
~{MCU_SPI3.CS5}: J9002.5 ; harness MCU_SPI3.~{CS5}  [project net MCU_SPI3~{.}CS5]
~{MCU_SPI5.CS0}: J9002.15 ; harness MCU_SPI5.~{CS0}  [project net MCU_SPI5~{.}CS0]
~{MCU_SPI5.CS1}: J9002.16 ; harness MCU_SPI5.~{CS1}  [project net MCU_SPI5~{.}CS1]
~{MCU_SPI5.CS2}: J9002.17 ; harness MCU_SPI5.~{CS2}  [project net MCU_SPI5~{.}CS2]
~{MCU_SPI5.CS3}: J9002.18 ; harness MCU_SPI5.~{CS3}  [project net MCU_SPI5~{.}CS3]
~{SBC_MCU_PGOOD}: J9002.81 ; port EXT_CON.~{SBC_MCU_PGOOD}  [project net EXT_CON~{.}SBC_MCU_PGOOD]
~{SBC_MCU_RESET}: J9002.80 ; port EXT_CON.~{SBC_MCU_RESET}  [project net EXT_CON~{.}SBC_MCU_RESET]
~{SBC_PER_PGOOD}: J9002.84 ; port EXT_CON.~{SBC_PER_PGOOD}  [project net EXT_CON~{.}SBC_PER_PGOOD]
~{SBC_PER_RESET}: J9002.83 ; port EXT_CON.~{SBC_PER_RESET}  [project net EXT_CON~{.}SBC_PER_RESET]
~{WW_ENABLE}: J9002.68 ; port EXT_CON.~{WW_ENABLE}  [project net EXT_CON~{.}WW_ENABLE]
~{WW_RESET}: J9002.69 ; port EXT_CON.~{WW_RESET}  [project net ~{DBG_RESET}]
AD1EVT: J9002.56 ; port EXT_CON.AD1EVT  [project net EXT_CON.AD1EVT]
AD1IN24: J9002.58
AD1IN25: J9002.59
AD1IN26: J9002.60
AD1IN27: J9002.61
AD2EVT: J9002.57 ; port EXT_CON.AD2EVT  [project net EXT_CON.AD2EVT]
AD2IN16: J9002.62
AD2IN17: J9002.63
AD2IN18: J9002.64
AD2IN19: J9002.65
ADDR0: J9001.17
ADDR1: J9001.18
ADDR2: J9001.19
ADDR3: J9001.20
ADDR4: J9001.21
ADDR5: J9001.22
ADDR6: J9001.23
ADDR7: J9001.24
ADDR8: J9001.25
ADDR9: J9001.26
ADDR10: J9001.27
ADDR11: J9001.28
ADDR12: J9001.29
ADDR13: J9001.30
ADDR14: J9001.31
ADDR15: J9001.32
ADDR16: J9001.33
ADDR17: J9001.34
ADDR18: J9001.35
ADDR19: J9001.36
ADDR20: J9001.37
ADDR21: J9001.38
DATA0: J9001.1
DATA1: J9001.2
DATA2: J9001.3
DATA3: J9001.4
DATA4: J9001.5
DATA5: J9001.6
DATA6: J9001.7
DATA7: J9001.8
DATA8: J9001.9
DATA9: J9001.10
DATA10: J9001.11
DATA11: J9001.12
DATA12: J9001.13
DATA13: J9001.14
DATA14: J9001.15
DATA15: J9001.16
DCC1: J9002.50 ; port EXT_CON.DCC1  [project net EXT_CON.DCC1]
ECAP4: J9002.53 ; port EXT_CON.ECAP4  [project net EXT_CON.ECAP4]
ECAP5: J9002.54 ; port EXT_CON.ECAP5  [project net EXT_CON.ECAP5]
EPWM1A: J9002.51 ; port EXT_CON.EPWM1A  [project net EXT_CON.EPWM1A]
EPWM1B: J9002.52 ; port EXT_CON.EPWM1B  [project net EXT_CON.EPWM1B]
IL_ENABLE_EXT: J9002.85 ; port EXT_CON.IL_ENABLE_EXT  [project net EXT_CON.IL_ENABLE_EXT]
IL_STATE: J9002.86 ; port EXT_CON.IL_STATE  [project net EXT_CON.IL_STATE]
MCU_A4: J9002.39 ; port EXT_CON.MCU_A4  [project net EXT_CON.MCU_A4]
MCU_A11: J9002.38 ; port EXT_CON.MCU_A11  [project net EXT_CON.MCU_A11]
MCU_A14: J9002.46 ; port EXT_CON.MCU_A14  [project net EXT_CON.MCU_A14]
MCU_B3: J9002.43 ; port EXT_CON.MCU_B3  [project net EXT_CON.MCU_B3]
MCU_CAN3.RX: J9002.33 ; harness MCU_CAN.RX
MCU_CAN3.TX: J9002.34 ; harness MCU_CAN.TX
MCU_CAN4.RX: J9002.35 ; harness MCU_CAN.RX
MCU_CAN4.TX: J9002.36 ; harness MCU_CAN.TX
MCU_EMIF.BA0: J9001.39 ; harness MCU_EMIF.BA0
MCU_EMIF.BA1: J9001.40 ; harness MCU_EMIF.BA1
MCU_EMIF.CKE: J9001.41 ; harness MCU_EMIF.CKE
MCU_EMIF.CLK: J9001.42 ; harness MCU_EMIF.CLK
MCU_FRAY1.RX: J9002.27 ; harness MCU_FRAY.RX
MCU_FRAY1.TX: J9002.28 ; harness MCU_FRAY.TX
MCU_FRAY1.TXEN: J9002.29 ; harness MCU_FRAY.TXEN
MCU_FRAY2.RX: J9002.30 ; harness MCU_FRAY.RX
MCU_FRAY2.TX: J9002.31 ; harness MCU_FRAY.TX
MCU_FRAY2.TXEN: J9002.32 ; harness MCU_FRAY.TXEN
MCU_GIOA7: J9002.37 ; port EXT_CON.MCU_GIOA7  [project net EXT_CON.MCU_GIOA7]
MCU_H4: J9002.42 ; port EXT_CON.MCU_H4  [project net EXT_CON.MCU_H4]
MCU_I2C1.SCL: J9002.20 ; harness MCU_I2C.SCL
MCU_I2C1.SDA: J9002.19 ; harness MCU_I2C.SDA
MCU_J1: J9002.40 ; port EXT_CON.MCU_J1  [project net EXT_CON.MCU_J1]
MCU_J4: J9002.44 ; port EXT_CON.MCU_J4  [project net EXT_CON.MCU_J4]
MCU_K19: J9002.47 ; port EXT_CON.MCU_K19  [project net EXT_CON.MCU_K19]
MCU_LIN1.RX: J9002.21 ; harness MCU_LIN.RX
MCU_LIN1.TX: J9002.22 ; harness MCU_LIN.TX
MCU_LIN2.RX: J9002.23 ; harness MCU_LIN.RX
MCU_LIN2.TX: J9002.24 ; harness MCU_LIN.TX
MCU_M16: J9002.48 ; port EXT_CON.MCU_M16  [project net EXT_CON.MCU_M16]
MCU_N16: J9002.49 ; port EXT_CON.MCU_N16  [project net EXT_CON.MCU_N16]
MCU_P1: J9002.45 ; port EXT_CON.MCU_P1  [project net EXT_CON.MCU_P1]
MCU_P2: J9002.41 ; port EXT_CON.MCU_P2  [project net EXT_CON.MCU_P2]
MCU_SCI3.RX: J9002.25 ; harness MCU_SCI.RX
MCU_SCI3.TX: J9002.26  [project net MCU_SCI3.TX_10]
MCU_SPI3.CLK: J9002.3 ; harness MCU_SPI3.CLK  [project net FLASH_SPI.CLK]
MCU_SPI3.SIMO: J9002.2 ; harness MCU_SPI3.SIMO  [project net FLASH_SPI.MOSI]
MCU_SPI3.SOMI: J9002.1 ; harness MCU_SPI3.SOMI  [project net FLASH_SPI.MISO]
MCU_SPI5.CLK: J9002.14 ; harness MCU_SPI5.CLK
MCU_SPI5.SIMO0: J9002.10 ; harness MCU_SPI5.SIMO0
MCU_SPI5.SIMO1: J9002.11 ; harness MCU_SPI5.SIMO1
MCU_SPI5.SIMO2: J9002.12 ; harness MCU_SPI5.SIMO2
MCU_SPI5.SIMO3: J9002.13 ; harness MCU_SPI5.SIMO3
MCU_SPI5.SOMI0: J9002.6 ; harness MCU_SPI5.SOMI0
MCU_SPI5.SOMI1: J9002.7 ; harness MCU_SPI5.SOMI1
MCU_SPI5.SOMI2: J9002.8 ; harness MCU_SPI5.SOMI2
MCU_SPI5.SOMI3: J9002.9 ; harness MCU_SPI5.SOMI3
SBC_MCU_FS0B: J9002.79 ; port EXT_CON.SBC_MCU_FS0B  [project net EXT_CON.SBC_MCU_FS0B]
SBC_PER_FS0B: J9002.82 ; port EXT_CON.SBC_PER_FS0B  [project net EXT_CON.SBC_PER_FS0B]
SMSW1_IN1: J9002.71
SMSW1_IN2: J9002.72
SMSW1_IN3: J9002.73
SMSW1_IN4: J9002.74
SMSW2_IN1: J9002.75
SMSW2_IN2: J9002.76
SMSW2_IN3: J9002.77
SMSW2_IN4: J9002.78
SMSW_LHM: J9002.70 ; port EXT_CON.SMSW_LHM  [project net EXT_CON.SMSW_LHM]

Not connected (* = marked no-connect by the designer): J9002 55*

### Buses and harness runs
bus AD1IN[0..31]
bus AD2IN[16..24]
bus ADDR[0..21]
bus DATA[0..15]
bus SMSW1_IN[1..4]
bus SMSW2_IN[1..4]
harness EXT_CON = port EXT_CON

### Layout directives
net class CON_EXTENSION: AD1EVT, AD1IN24, AD1IN25, AD1IN26, AD1IN27, AD2EVT, AD2IN16, AD2IN17, AD2IN18, AD2IN19, DCC1, ECAP4, ECAP5, EPWM1A, EPWM1B, IL_ENABLE_EXT, IL_STATE, MCU_A4, MCU_A11, MCU_A14, MCU_B3, MCU_CAN3.RX, MCU_CAN3.TX, MCU_CAN4.RX, MCU_CAN4.TX, MCU_FRAY1.RX, MCU_FRAY1.TX, MCU_FRAY1.TXEN, MCU_FRAY2.RX, MCU_FRAY2.TX, MCU_FRAY2.TXEN, MCU_GIOA7, MCU_H4, MCU_I2C1.SCL, MCU_I2C1.SDA, MCU_J1, MCU_J4, MCU_K19, MCU_LIN1.RX, MCU_LIN1.TX, MCU_LIN2.RX, MCU_LIN2.TX, MCU_M16, MCU_N16, MCU_P1, MCU_P2, MCU_SCI3.RX, MCU_SCI3.TX, MCU_SPI3.CLK, MCU_SPI3.SIMO, MCU_SPI3.SOMI, MCU_SPI5.CLK, MCU_SPI5.SIMO0, MCU_SPI5.SIMO1, MCU_SPI5.SIMO2, MCU_SPI5.SIMO3, MCU_SPI5.SOMI0, MCU_SPI5.SOMI1, MCU_SPI5.SOMI2, MCU_SPI5.SOMI3, SBC_MCU_FS0B, SBC_PER_FS0B, SMSW1_IN1, SMSW1_IN2, SMSW1_IN3, SMSW1_IN4, SMSW2_IN1, SMSW2_IN2, SMSW2_IN3, SMSW2_IN4, SMSW_LHM, ~{MCU_SPI3.CS4}, ~{MCU_SPI3.CS5}, ~{MCU_SPI5.CS0}, ~{MCU_SPI5.CS1}, ~{MCU_SPI5.CS2}, ~{MCU_SPI5.CS3}, ~{SBC_MCU_PGOOD}, ~{SBC_MCU_RESET}, ~{SBC_PER_PGOOD}, ~{SBC_PER_RESET}, ~{WW_ENABLE}, ~{WW_RESET}

### Notes on the sheet
- used internal
- from IO matrix
- Fraunhofer IISB
- Schottkystr. 10
- developed by:
- 91058 Erlangen
- Germany
- Author
- Project
- License
- Description
- File
- Version
- Release Date
- Sheet
- foxbms.org <https://foxbms.org>
- www.iisb.fraunhofer.de <https://www.iisb.fraunhofer.de/>
- foxBMS Team
- /

### Library data of the parts
J9001 = SAMTEC_ERM8-030-09.0-L-DV-K-TR: Edge Rate rugged high-speed connector strips; Manufacturer: Samtec; Circuits: 60; Automotive Qualified: False; Part Number: SAMTEC_ERM8-030-09.0-L-DV-K-TR; Part Name: ERM8-030-09.0-L-DV-K-TR; Operating Temperature: -55°C - +125°C; ComponentLink1Description: Datasheet; ComponentLink1URL: https://suddendocs.samtec.com/catalog_english/erm8.pdf; Supplier 1: Digikey; Supplier Part Number 1: SAM13766CT-ND; Supplier 2: Mouser; Supplier Part Number 2: 200-ERM8030090LDVKTR; ECCN: EAR99
J9002 = SAMTEC_ERM8-060-09.0-L-DV-K-TR: Edge Rate rugged high-speed connector strips; Manufacturer: Samtec; Circuits: 120; Automotive Qualified: False; Part Number: SAMTEC_ERM8-060-09.0-L-DV-K-TR; Part Name: ERM8-060-09.0-L-DV-K-TR; Operating Temperature: -55°C - +125°C; ComponentLink1Description: Datasheet; ComponentLink1URL: https://suddendocs.samtec.com/catalog_english/erm8.pdf; Supplier 1: Digikey; Supplier Part Number 1: SAM13147CT-ND; Supplier 2: Mouser; Supplier Part Number 2: 200-ERM8060090LDVKTR; ECCN: EAR99